# Altium schematic sheet USB-ISO.SchDoc: =GlobalProjectName
size 594 x 420 mm; CheckedBy: A_D; Author: A_D; SheetTotal: 1; PageSetup: Record=PageOptions|CenterHorizontal=True|CenterVertical=True|PrintScale=0.70|XCorrection=1.00|YCorrection=1.00|PrintKind=2|BorderSize=5000000|LeftOffset=9000|BottomOffset=10100|Orientation=2|PaperLength=11176|PaperWidth=8636|Scale=100|PaperSource=259|PrintQuality=-3|MediaType=1|DitherType=10|PrintScaleMode=1|PaperKind=A3|PaperIndex=8
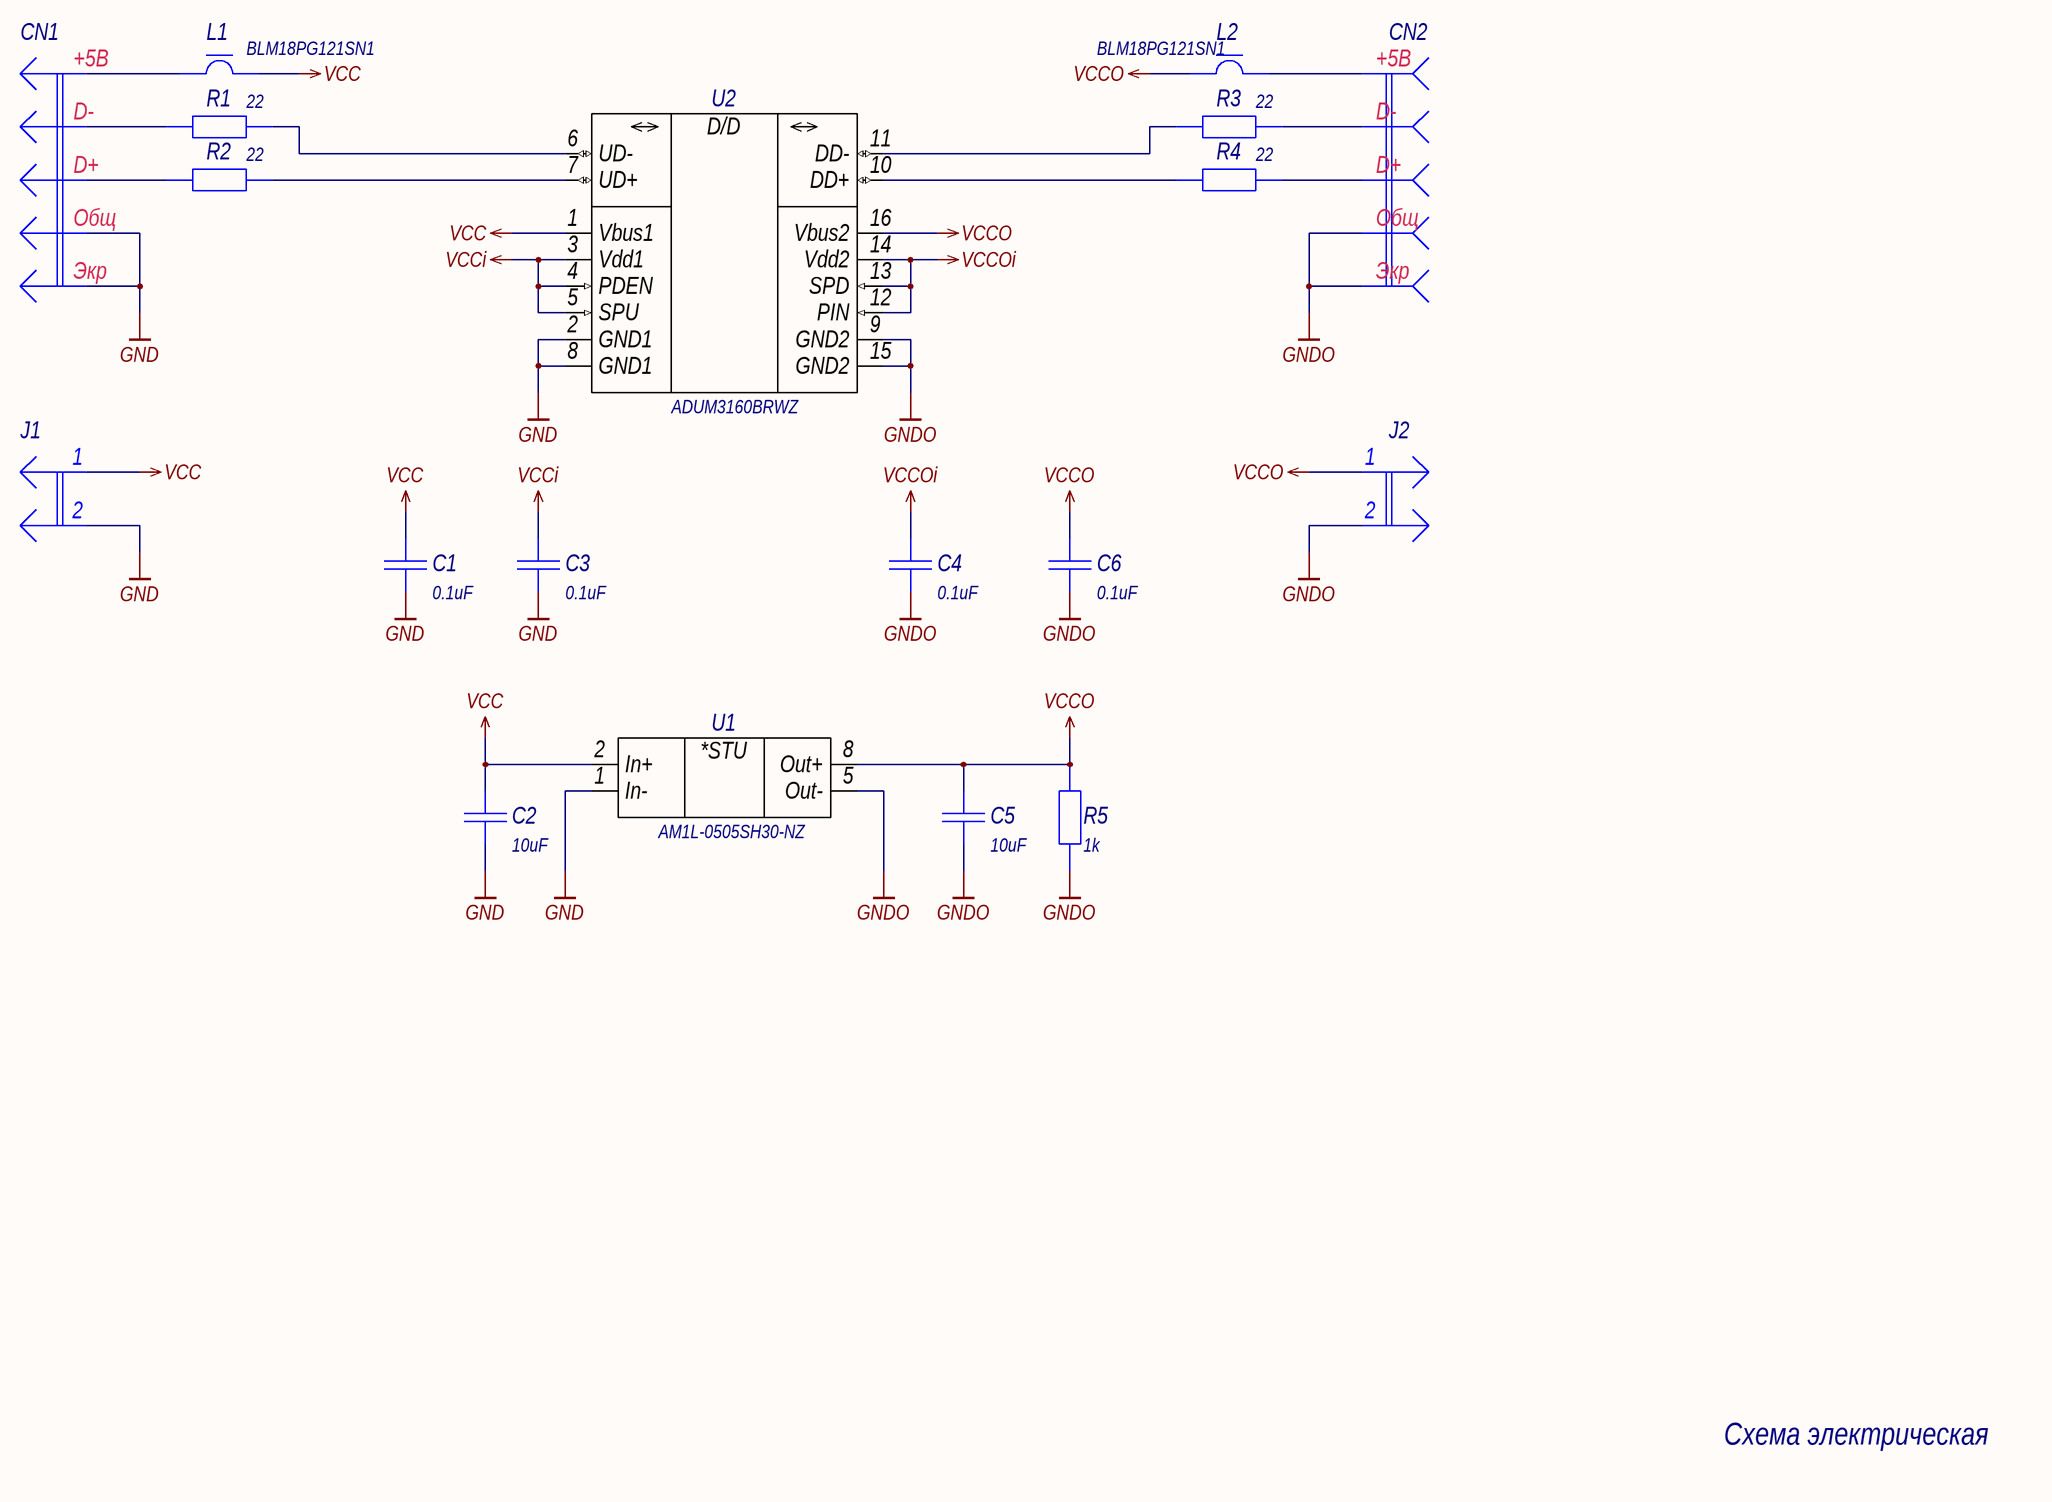
[diagram p0: USB-ISO.SchDoc]

## Parts
C1  value 0.1uF  [C0603]  (hidden comment: Capacitor)
C2  value 10uF  [C0805]  (hidden comment: Capacitor)
C3  value 0.1uF  [C0603]  (hidden comment: Capacitor)
C4  value 0.1uF  [C0603]  (hidden comment: Capacitor)
C5  value 10uF  [C0805]  (hidden comment: Capacitor)
C6  value 0.1uF  [C0603]  (hidden comment: Capacitor)
CN1  Text  [DS1097]  (value not drawn)
CN2  Text  [DS1095]  (value not drawn)
J1  Text  [PLS-2]  (value not drawn)
J2  Text  [PLS-2]  (value not drawn)
L1  value BLM18PG121SN1  [L0603]  (hidden comment: FerriteBead)
L2  value BLM18PG121SN1  [L0603]  (hidden comment: FerriteBead)
R1  value 22  [R0603]  (hidden comment: Resistor)
R2  value 22  [R0603]  (hidden comment: Resistor)
R3  value 22  [R0603]  (hidden comment: Resistor)
R4  value 22  [R0603]  (hidden comment: Resistor)
R5  value 1k  [R0603]  (hidden comment: Resistor)
U1  value AM1L-0505SH30-NZ  [AM1L-xxxxDH30-NZ-Series]  (hidden comment: AM1L-xxxxSH30-Series)
U2  value ADUM3160BRWZ  [SOIC-16W]  (hidden comment: ADuMx160-Series)

## Nets
GND: C1.1 C2.1 C3.1 CN1.4 CN1.5 J1.2 U1.1(In-) U2.2(GND1) U2.8(GND1)
GNDO: C4.1 C5.1 C6.1 CN2.4 CN2.5 J2.2 R5.1 U1.5(Out-) U2.9(GND2) U2.15(GND2)
VCC: C1.2 C2.2 J1.1 L1.2 U1.2(In+) U2.1(Vbus1)
VCCi: C3.2 U2.3(Vdd1) U2.4(PDEN) U2.5(SPU)
VCCO: C5.2 C6.2 J2.1 L2.1 R5.2 U1.8(Out+) U2.16(Vbus2)
VCCOi: C4.2 U2.12(PIN) U2.13(SPD) U2.14(Vdd2)
NetCN1_1: CN1.1 L1.1
NetCN1_2: CN1.2 R1.1
NetCN1_3: CN1.3 R2.1
NetCN2_1: CN2.1 L2.2
NetCN2_2: CN2.2 R3.1
NetCN2_3: CN2.3 R4.1
NetR1_2: R1.2 U2.6(UD-)
NetR2_2: R2.2 U2.7(UD+)
NetR3_2: R3.2 U2.11(DD-)
NetR4_2: R4.2 U2.10(DD+)

## Notes on the sheet
- Схема электрическая
  принципиальная
- Перв. примен.
- Справ. №
- ПЗ:                             Дата
- Подп. и дата
- Инв. № дубл.
- Взам. инв. №
- Разраб.
- Изм.
- Лист
- № докум.
- Подп.
- Дата
- Литера
- Масса
- Масштаб
- Пров.
- Т.контр.
- Листов
- Инв. № подл.
- Н.контр.
- Утв.
- Форма 1 ГОСТ 2.104-2006
- Копировал
- Формат А2
- (in symbol ADUM3160BRWZ) D/D
- (in symbol AM1L-0505SH30-NZ) *STU
- (in symbol DS1095-B-R) +5В; D-; D+; Общ; Экр
- (in symbol DS1097-B) +5В; D-; D+; Общ; Экр

## Library data of the parts
C1 C3 C4 C6 = GRM188R71C104KA01D: Manufacturer: Murata; Type: Конденсатор; ID: 131; Voltage: 16V; Tolerance: ±10%; Dielectric Type: X7R; Application Category: 1; Working Temperature Min: -55°С; Working Temperature Max: +125°С; Published: 18.05.2010; Publisher: A_D; Part Number: GRM188R71C104KA01D; Footprint: 0603
C2 C5 = GRM219R60J106KE19D: Manufacturer: Murata; Type: Конденсатор; ID: 141; Voltage: 6.3V; Tolerance: ±20%; Dielectric Type: X5R; Application Category: 1; Working Temperature Min: -55°С; Working Temperature Max: +85°С; Published: 18.05.2010; Publisher: A_D; Part Number: GRM219R60J106KE19D; Footprint: 0805
CN1 = DS1097-B: Manufacturer: Connfly Electronic Co., Ltd; ID: 3; Limit Voltage: 30V; Limit Current: 1.5A; Connector Type: Male; Interface: USB 2.0; Max Data Rate: 480 mbps; Application Category: 1; Functional Analog: USB-AR, DS1097-W; Published: 13.08.2015; Publisher: A_D; Type: Вилка; Part Number: DS1097-B; Value: DS1097-B; Pins: 6; Mount Type: Through hole
CN2 = DS1095-B-R: Manufacturer: Connfly Electronic Co., Ltd; ID: 19; Limit Voltage: 30V; Limit Current: 1.5A; Connector Type: Female; Interface: USB 2.0; Max Data Rate: 480 mbps; Application Category: 1; Value: DS1095-B-R; Published: 07.03.2013; Publisher: A_D; Type: Розетка; Part Number: DS1095-B-R; Pins: 6; Mount Type: Through hole
J1 J2 = PLS-2: Value: PLS-2; ID: 1; Limit Voltage: 250V; Limit Current: 3A; Connector Type: Male; Resistance: 15momh; Surface Finish: Gold; Pitch: 2.54mm; Published: 07.03.2013; Publisher: A_D; Type: Вилка; Part Number: PLS-2; Pins: 2
L1 L2 = BLM18PG121SN1: Manufacturer: Murata; Type: Дроссель; ID: 4; Rated Current: 2A; Impedance at 100Mhz: 120ohm; DC Resistance: 0.05ohm; Inductor Type: EMIFIL; Application Category: 1; Working Temperature Min: -55°С; Working Temperature Max: +125°С; Published: 14.11.2014; Publisher: A_D; Part Number: BLM18PG121SN1; Footprint: 0603
R1-R4 = RC0603JR-0722RL: Manufacturer: Yageo; ID: 29; Limit Voltage: 50V; Tolerance: ±5%; Temperature Coefficient: 100ppm; Total Power Dissipation: 0.1W; Series Type: Thick-Film; Application Category: 1; Working Temperature Min: -55°С; Working Temperature Max: +155°С; Published: 24.03.2010; Publisher: A_D; Type: Резистор; Part Number: RC0603JR-0722RL; Footprint: 0603
R5 = RC0603JR-071KL: Manufacturer: Yageo; ID: 19; Limit Voltage: 50V; Tolerance: ±5%; Temperature Coefficient: 100ppm; Total Power Dissipation: 0.1W; Series Type: Thick-Film; Application Category: 1; Working Temperature Min: -55°С; Working Temperature Max: +155°С; Functional Analog: CR0603-JW-102E; Published: 24.03.2010; Publisher: A_D; Type: Резистор; Part Number: RC0603JR-071KL; Footprint: 0603
U1 = AM1L-0505SH30-NZ: Manufacturer: Aimtec; ID: 2; Supply Operation: +4.5…5.5V; Output Current Min: ±20mA; Output Current Max: ±200mA; Output Voltage: +5V; Efficiency: 70%; I-O Isolation: 3kV; Application Category: 1; Working Temperature Min: -40°С; Working Temperature Max: +85°С; Published: 29.07.2015; Publisher: A_D; Type: Микросхема; Part Number: AM1L-0505SH30-NZ; Functional Analog: -
U2 = ADUM3160BRWZ: Manufacturer: Analog Devices; ID: 1; Supply Operation: +4.5…5.5V; Supply Current: 8mA; Data Rate: 12Mbts; Forward Channels: 2; Peak-to-peak Jitter: 3ns; Interface: USB 2.0; Functional Analog: ADUM4160BRWZ; Published: 29.07.2015; Publisher: A_D; Type: Микросхема; Part Number: ADUM3160BRWZ; Opposite Channels: 2; Application Category: 1